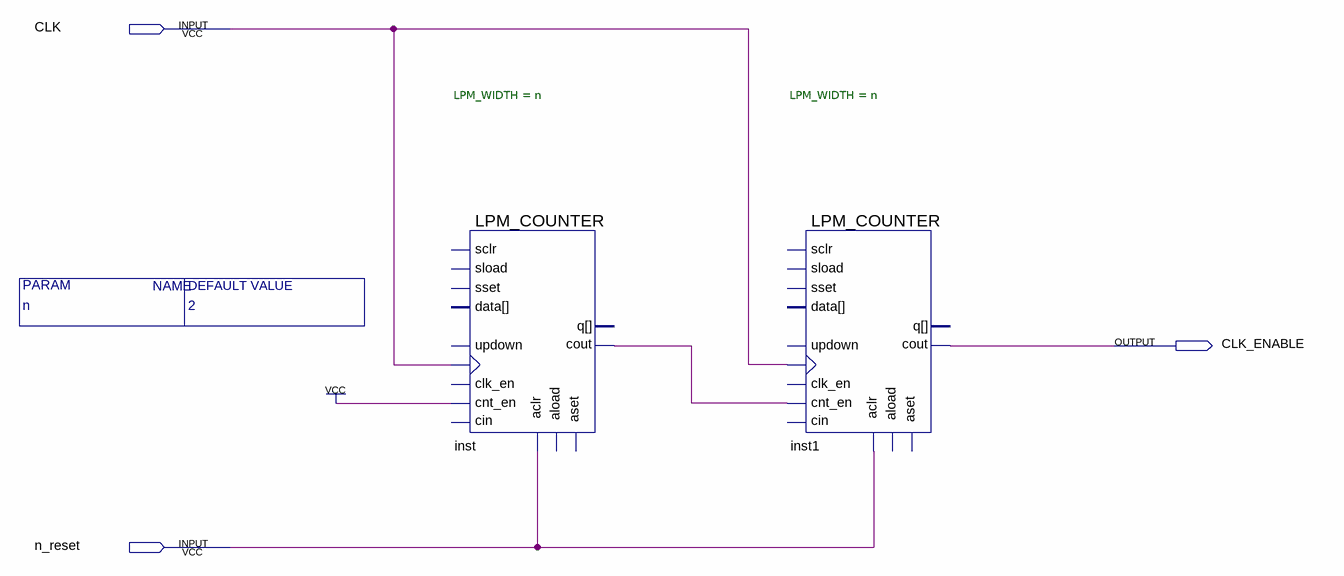
[diagram p0: schematic sheet]
// Quartus schematic altera_divider.bdf as structural Verilog: 2 symbols, 3 pins
module altera_divider #(parameter n = 2) (
  input  CLK,
  input  n_reset,
  output CLK_ENABLE
);

  wire inst_cout;

  LPM_COUNTER #(.LPM_WIDTH(n)) inst (
    .clock(CLK), .aclr(n_reset), .cnt_en(1'b1), .cout(inst_cout));  // open: sload, data, clk_en, aload, aset, cin, sset, updown, sclr, q
  LPM_COUNTER #(.LPM_WIDTH(n)) inst1 (
    .clock(CLK), .aclr(n_reset), .cnt_en(inst_cout), .cout(CLK_ENABLE));  // open: sload, data, clk_en, aload, aset, cin, sset, updown, sclr, q
endmodule
